# Altium schematic sheet Sheet1.SchDoc
size A3; SheetNumber: 1; SheetTotal: 1
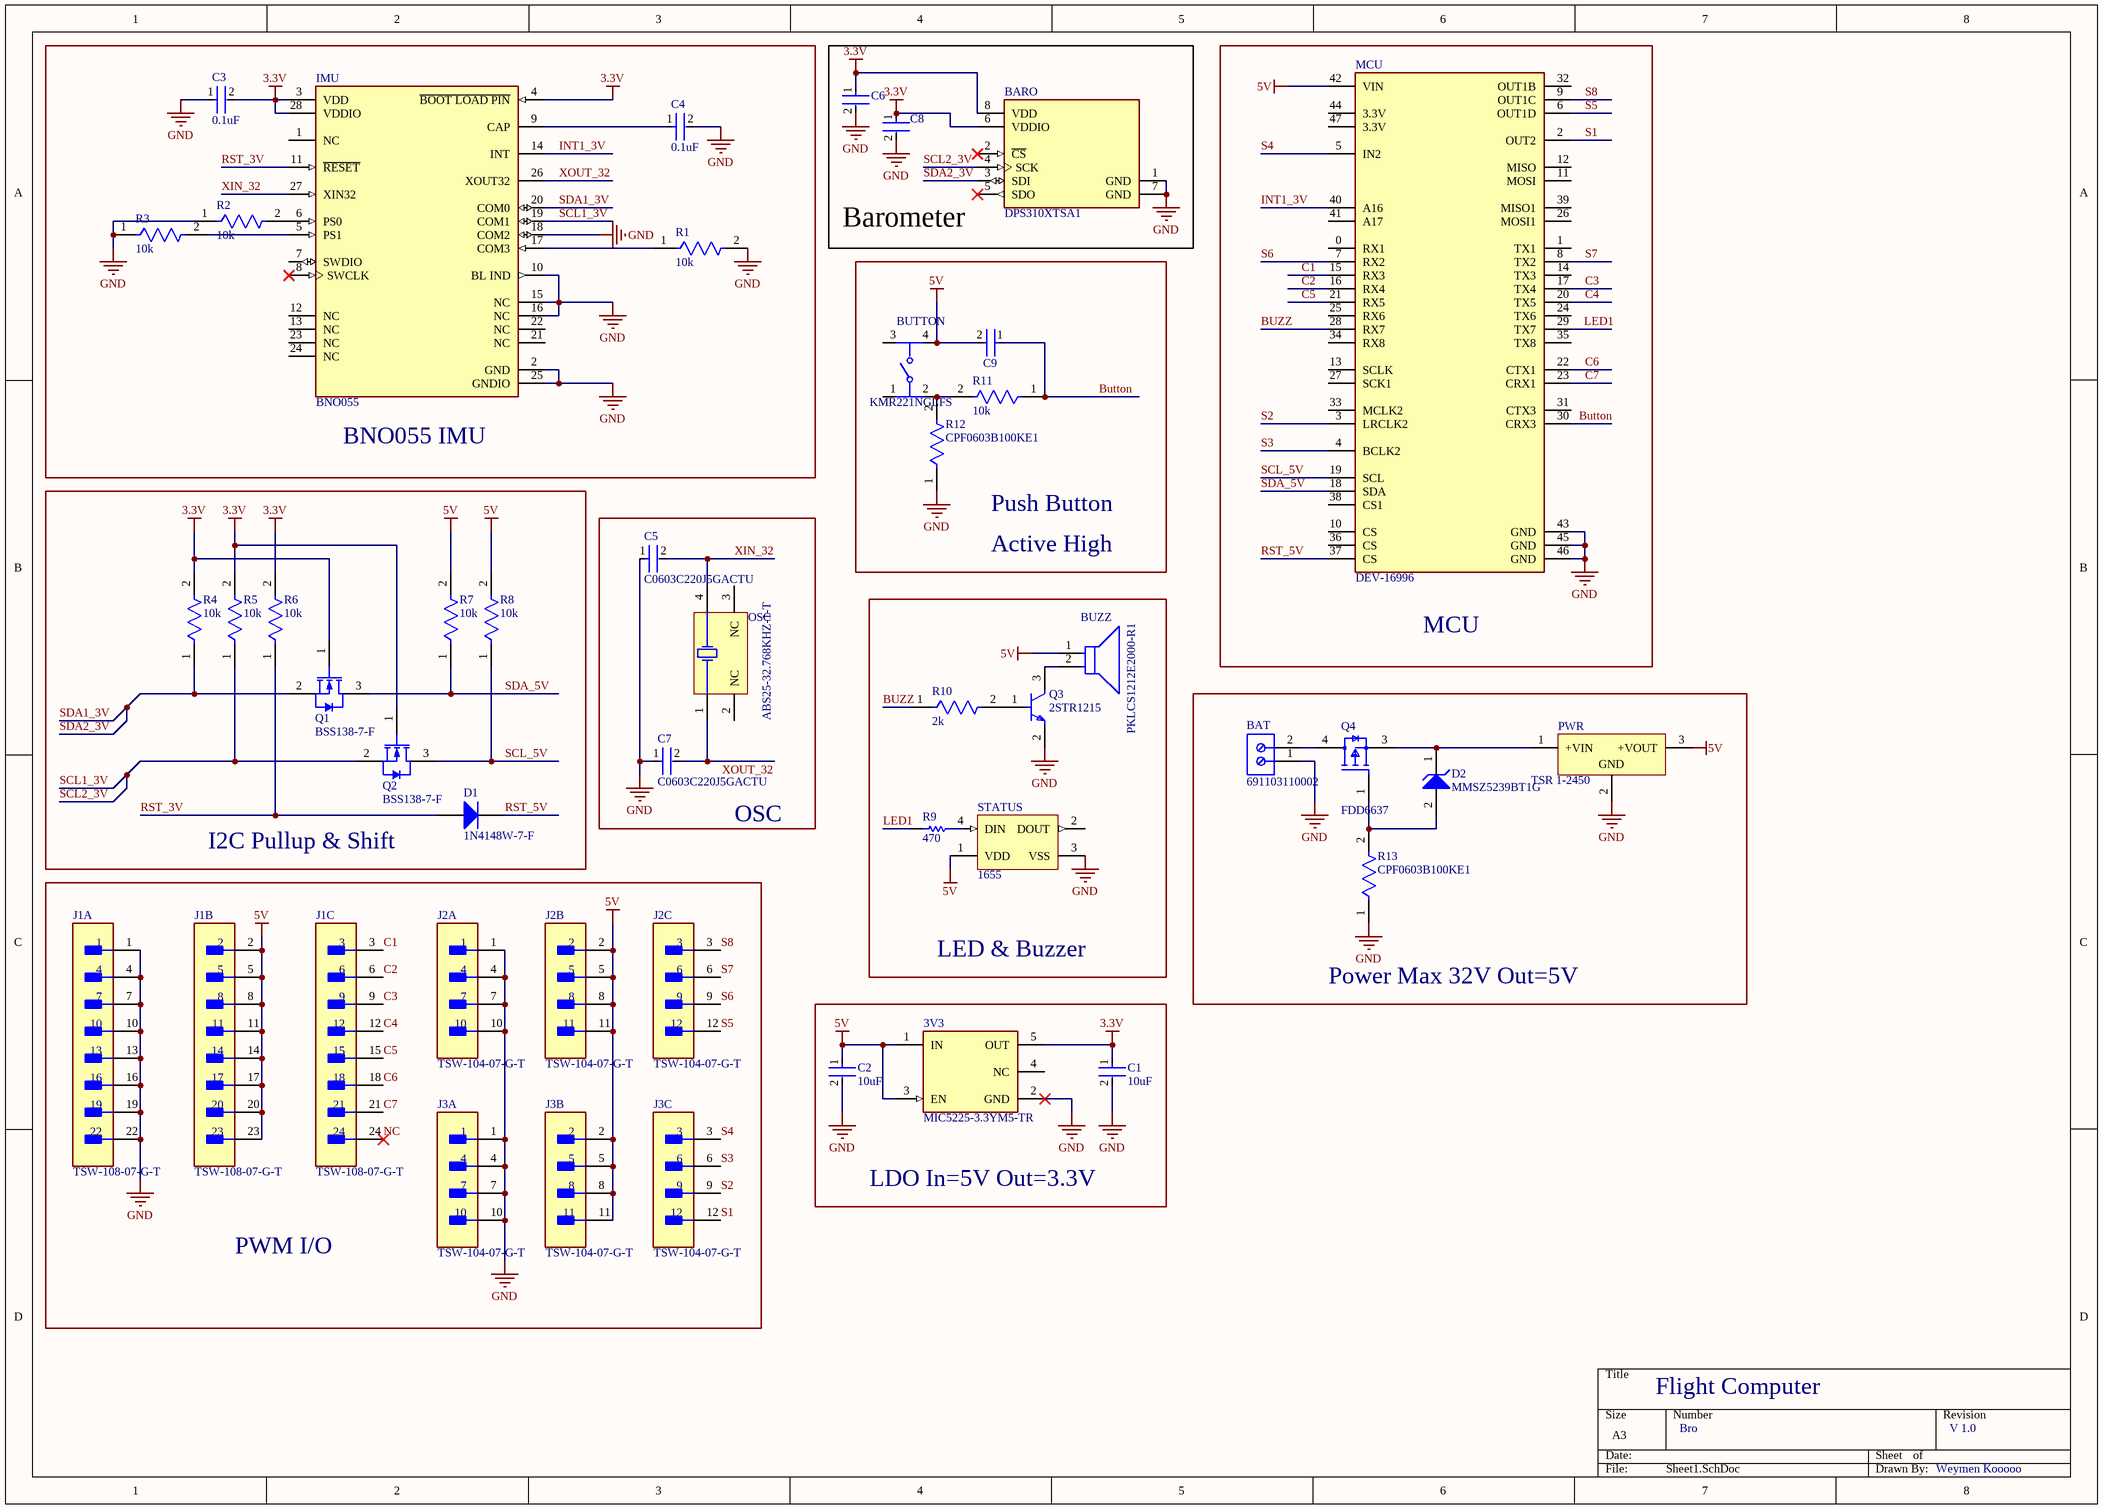
[diagram p0: Sheet1.SchDoc]

## Parts
3V3  MIC5225-3.3YM5-TR  [FP-SOT23-5LD-PL-1-MFG]
BARO  DPS310XTSA1  [FP-PG-VLGA-8-MFG]
BAT  691103110002  [691103110002]
BUTTON  KMR221NGLFS  [FP-KMR221NGLFS-0]
BUZZ  PKLCS1212E2000-R1  [FP-PKLCS1212E2000-R1-MFG]
C1  10uF  [FP-GRM188-0_1-e0_2_0_55-IPC_A]
C2  10uF  [FP-GRM188-0_1-e0_2_0_55-IPC_A]
C3  0.1uF  [FP-C0603C-CF-MFG]
C4  0.1uF  [FP-C0603C-CF-MFG]
C5  C0603C220J5GACTU  [FP-C0603C-CF-MFG]
C6  CGA3E2X7R1H104K080AA  [FP-CGA3E-0_3-0_1-IPC_A]  (value not drawn)
C7  C0603C220J5GACTU  [FP-C0603C-CF-MFG]
C8  CGA3E2X7R1H104K080AA  [FP-CGA3E-0_3-0_1-IPC_A]  (value not drawn)
C9  CGA3E2X7R1H104K080AA  [FP-CGA3E-0_3-0_1-IPC_A]  (value not drawn)
D1  1N4148W-7-F  [DIOD-SOD123-2_V]
D2  MMSZ5239BT1G  [ONSC-SOD-123-2-425-04_V]
IMU  BNO055  [FP-BNO055-MFG]
J1  TSW-108-07-G-T  [FP-TSW-108-07-G-T-MFG]  (parts A,B,C of 3)
J2  TSW-104-07-G-T  [FP-TSW-104-07-G-T-MFG]  (parts A,B,C of 3)
J3  TSW-104-07-G-T  [FP-TSW-104-07-G-T-MFG]  (parts A,B,C of 3)
MCU  DEV-16996  [FP-DEV-16996-MFG]  (no BOM)
OSC  ABS25-32.768KHZ-1-T  [ABRA-ABS25-4_V]
PWR  TSR 1-2450  [TRACO-SIP-3_V]
Q1  BSS138-7-F  [DIOD-SOT23-3_V]
Q2  BSS138-7-F  [DIOD-SOT23-3_V]
Q3  2STR1215  [FP-SOT23_8162275-MFG]
Q4  FDD6637  [FP-369AS-MFG]
R1  10k  [FP-RC0603-0_55-IPC_C]
R2  10k  [FP-RC0603-0_55-IPC_C]
R3  10k  [FP-RC0603-0_55-IPC_C]
R4  10k  [FP-RC0603-0_55-IPC_C]
R5  10k  [FP-RC0603-0_55-IPC_C]
R6  10k  [FP-RC0603-0_55-IPC_C]
R7  10k  [FP-RC0603-0_55-IPC_C]
R8  10k  [FP-RC0603-0_55-IPC_C]
R9  470  [RESC1608X55X30NL15T15]
R10  2k  [FP-ERA3A-IPC_C]
R11  10k  [FP-RC0603-0_55-IPC_C]
R12  CPF0603B100KE1  [FP-CPF0603-MFG]
R13  CPF0603B100KE1  [FP-CPF0603-MFG]
STATUS  1655  [ADA-RGB-1655_V]

## Blocks framed on the sheet
BNO055 IMU: C3 C4 IMU R1-R3
Barometer: BARO C6 C8
MCU: MCU
I2C Pullup & Shift: D1 Q1 Q2 R4-R8
OSC: C5 C7 OSC
LED & Buzzer: BUZZ Q3 R9 R10 STATUS
Power Max 32V Out=5V: BAT D2 PWR Q4 R13
PWM I/O: J1-J3
LDO In=5V Out=3.3V: 3V3 C1 C2

## Nets
3.3V: 3V3.5(OUT) BARO.6(VDDIO) BARO.8(VDD) C1.1 C3.2 C6.1 C8.1 IMU.3(VDD) IMU.4(~{BOOT_LOAD_PIN}) IMU.28(VDDIO) Q1.1(G) Q2.1(G) R4.2 R5.2 R6.2
5V: 3V3.1(IN) 3V3.3(EN) BUTTON.4 BUZZ.1 C2.1 C9.2 J1.2 J1.5 J1.8 J1.11 J1.14 J1.17 J1.20 J1.23 J2.2 J2.5 J2.8 J2.11 J3.2 J3.5 J3.8 J3.11 MCU.42(VIN) PWR.3(+VOUT) R7.2 R8.2 STATUS.1(VDD)
GND: 3V3.2(GND) BARO.1(GND) BARO.7(GND) BAT.1 C1.2 C2.2 C3.1 C4.2 C5.1 C6.2 C7.1 C8.2 IMU.2(GND) IMU.10(BL_IND) IMU.15(NC) IMU.16(NC) IMU.18(COM2) IMU.25(GNDIO) J1.1 J1.4 J1.7 J1.10 J1.13 J1.16 J1.19 J1.22 J2.1 J2.4 J2.7 J2.10 J3.1 J3.4 J3.7 J3.10 MCU.43(GND) MCU.45(GND) MCU.46(GND) PWR.2(GND) Q3.2(E) R1.2 R2.1 R3.1 R12.1 R13.1 STATUS.3(VSS)
Button: C9.1 MCU.30(CRX3) R11.1
BUZZ: MCU.28(RX7) R10.1
C1: J1.3 MCU.15(RX3)
C2: J1.6 MCU.16(RX4)
C3: J1.9 MCU.17(TX4)
C4: J1.12 MCU.20(TX5)
C5: J1.15 MCU.21(RX5)
C6: J1.18 MCU.22(CTX1)
C7: J1.21 MCU.23(CRX1)
INT1_3V: IMU.14(INT) MCU.40(A16)
LED1: MCU.29(TX7) R9.1
NC: J1.24
RST_3V: D1.1(A) IMU.11(~{RESET}) R6.1
RST_5V: D1.2(K) MCU.37(CS)
S1: J3.12 MCU.2(OUT2)
S2: J3.9 MCU.3(LRCLK2)
S3: J3.6 MCU.4(BCLK2)
S4: J3.3 MCU.5(IN2)
S5: J2.12 MCU.6(OUT1D)
S6: J2.9 MCU.7(RX2)
S7: J2.6 MCU.8(TX2)
S8: J2.3 MCU.9(OUT1C)
SCL1_3V: BARO.4(SCK) IMU.19(COM1) Q2.2(S) R5.1  [also labelled SCL2_3V]
SCL_5V: MCU.19(SCL) Q2.3(D) R8.1
SDA1_3V: BARO.3(SDI) IMU.20(COM0) Q1.2(S) R4.1  [also labelled SDA2_3V]
SDA_5V: MCU.18(SDA) Q1.3(D) R7.1
XIN_32: C5.2 IMU.27(XIN32) OSC.4(X2)
XOUT_32: C7.2 IMU.26(XOUT32) OSC.1(X1)
NetBAT_2: BAT.2 Q4.4(D)
NetBUTTON_2: BUTTON.2 R11.2 R12.2
NetBUZZ_2: BUZZ.2 Q3.3(C)
NetC4_1: C4.1 IMU.9(CAP)
NetD2_1: D2.1(K) PWR.1(+VIN) Q4.3(S)
NetD2_2: D2.2(A) Q4.1(G) R13.2
NetIMU_5: IMU.5(PS1) R3.2
NetIMU_6: IMU.6(PS0) R2.2
NetIMU_17: IMU.17(COM3) R1.1
NetQ3_1: Q3.1(B) R10.2
NetR9_2: R9.2 STATUS.4(DIN)

Not connected (* = marked no-connect by the designer): 3V3 4(NC); BARO 2(~{CS})* 5(SDO)*; BUTTON 1 3; IMU 1(NC) 7(SWDIO) 8(SWCLK)* 12(NC) 13(NC) 21(NC) 22(NC) 23(NC) 24(NC); MCU 0(RX1) 1(TX1) 10(CS) 11(MOSI) 12(MISO) 13(SCLK) 14(TX3) 24(TX6) 25(RX6) 26(MOSI1) 27(SCK1) 31(CTX3) 32(OUT1B) 33(MCLK2) 34(RX8) 35(TX8) 36(CS) 38(CS1) 39(MISO1) 41(A17) 44(3.3V) 47(3.3V); OSC 2(NC) 3(NC); STATUS 2(DOUT)

## Notes on the sheet
- Push Button
- Active High
- Flight Computer
- Bro
- V 1.0
- Weymen Kooooo

## Library data of the parts
3V3 = CMP-06324-000013-1: IC REG LINEAR 3.3V 150MA SOT23-5; Manufacturer: Microchip Technology; Max Supply Voltage: 16V; Output Type: Fixed; Accuracy Percentage: 1%; Number Of Outputs: 1; Standoff Height: 0mm; Min Supply Voltage: 2.3V; Dropout Voltage: 310mV; Max Junction Temp: +125°C; Nominal Supply Current: 29-3000uA; Output Current: 150mA; Height: 1.45mm; Device Class L3: Voltage Regulators - Linear; Temperature Range High: +125°C; Temperature Range Low: -40°C; Device Class L2: Power Management ICs; Device Class L1: Integrated Circuits (ICs); Manufacturer Part Number: MIC5225-3.3YM5-TR; Output Voltage: 3.3V; ComponentLink2Description: Datasheet; Package: SOT23-5LD-PL-1; ComponentLink2URL: http://ww1.microchip.com/downloads/en/DeviceDoc/mic5225.pdf; Mouser Description: LDO Voltage Regulators High Vin, Low Iq Regulator (Lead Free); RoHS: TRUE; Automotive: No; Temperature: -40°C to +125°C; Category: IC; Octopart: https://octopart.com/mic5225-3.3ym5-tr-microchip-66802280; Lead Free: Yes; Digikey Description: IC REG LINEAR 3.3V 150MA SOT23-5
BARO = CMP-32885-000002-2: SENSOR PRESSURE CAPACITIVE; Max Supply Voltage: 3.6V; Interface: I2C; Operating Pressure: 17.4PSI; Pressure Type: Vented Gauge; Max Pressure: 145PSI; Output Type: SPI; Min Operating Temperature: -40°C; Lead Free: Lead Free; Termination: SMD/SMT; Halogen Free: Halogen Free; Case/Package: LGA; Max Operating Temperature: 85°C; Number of Pins: 8
BAT = CMP-1502-03254-1: Series 1031 - 3.50 mm Horizontal Entry Modular with Pressure Clamp WR-TBL, 2 pin; Manufacturer: Wurth Elektronik; Pin Number: 2; Pitch: 3.50mm; Datasheet URL: http://katalog.we-online.de/em/datasheet/6911031100xx.pdf; Package Reference: 691103110002; Publisher: WurthElektronik; Manufacturer URL: http://www.we-online.de; Mounting Technology: THT; Operating Temperature: -40to105degC; Part Number: 691103110002; Packaging: Box
BUTTON = CMP-10040-000006-1: SWITCH TACTILE SPST-NO 0.05A 32V; Manufacturer: C&K; Contact Current Rating: 50mA; Operating Force: 2N; Contact Resistance: 100mΩ; Electromechanical Life: 200000Cycles; Digikey Description: SWITCH TACTILE SPST-NO 0.05A 32V; Manufacturer Part Number: KMR221NGLFS; Octopart: https://octopart.com/kmr221nglfs-c%26k+components-7203802; Package: 0; Temperature: -40°C to +85°C; Mount: Surface Mount; Device Class L2: Switches; Height: 1.9mm; Device Class L3: Tactile Switches; RoHS: TRUE; Lead Free: Yes; ComponentLink2Description: Datasheet; Device Class L1: Electromechanical; Automotive: No; Mouser Description: Tactile Switches Tact; Category: Switch; Temperature Range High: +85°C; Temperature Range Low: -40°C; Voltage Rating Dc: 32V; ComponentLink2URL: https://dznh3ojzb2azq.cloudfront.net/products/Tactile/KMR2/documents/datasheet.pdf; Throw Configuration: SPST-NO
BUZZ = CMP-06202-000001-1: AUDIO PIEZO TRANSDUCER 12.5V SMD; Manufacturer: Murata; Frequency: 2kHz; Digikey Description: AUDIO PIEZO TRANSDUCER 12.5V SMD; RoHS: TRUE; Device Class L3: Buzzers; Manufacturer Part Number: PKLCS1212E2000-R1; Automotive: No; Category: Speak; Height: 3mm; Operating Supply Voltage: 12.5V; Mouser Description: Piezo buzzer SMD; Temperature Range High: +70°C; Temperature Range Low: -20°C; ComponentLink2Description: Datasheet; ComponentLink2URL: https://www.murata.com/en-global/products/productdata/8801054425118/SPEC-PKLCS1212E2000-R1.pdf?1517839212000; Package: PKLCS1212E2000-R1; Device Class L1: Electromechanical; Device Class L2: Audio Products; Lead Free: Yes; Temperature: -20°C to +70°C; Octopart: https://octopart.com/pklcs1212e2000-r1-murata-7123179
C1 C2 = CMP-2006-02792-2: Chip Multilayer Ceramic Capacitors for General Purpose, 0603, 10uF, X5R, 15%, 20%, 6.3V; Packaging: Tape and Reel; Voltage Rating (DC): 6.3V; Width: 0.031inch; Termination: SMD/SMT; Dielectric: X5R; Package Quantity: 4000; Voltage Rating: 6.3V; Capacitance: 10uF; Case/Package: 0603; Min Operating Temperature: -55°C; Voltage: 6.3V; Length: 1.6mm; Thickness: 0.035inch; Lead Free: Lead Free; Depth: 0.8mm; Case Code (Imperial): 0603; Max Operating Temperature: 85°C; Material: Ceramic; Height: 0.8mm; Tolerance: 20%; Mount: Surface Mount; REACH SVHC: No SVHC; Radiation Hardening: No; Case Code (Metric): 1608
C3 C4 = CMP-2006-03061-2: CAP CER 0.1UF 50V X7R 0603; Manufacturer: KEMET; Manufacturer Part Number: C0603C104K5RACTU; Tolerance: 0.1; Temperature Coefficient: 30ppm/°C; Material: Ceramic; Automotive Grade: Grade 1; Value: 0.10 μF; Temperature: -55°C to +125°C; RoHS: TRUE; Temperature Range High: +125°C; Lead Free: Yes; Octopart: https://octopart.com/c0603c104k5ractu-kemet-139244; Digikey Description: CAP CER 0.1UF 50V X7R 0603; Category: Cap; Package: C0603C-CF; ComponentLink2Description: Datasheet; Temperature Range Low: -55°C; Device Class L1: Passive Components; Voltage Rating: 50 V; Automotive: Yes; Device Class L3: Ceramic Capacitors; ComponentLink2URL: https://api.kemet.com/component-edge/download/datasheet/C0603C100J5GACAUTO.pdf; Capacitance: 0.10 μF; Device Class L2: Capacitors; Temperature Characteristic: X7R; Height: 0.87mm
C5 C7 = CMP-2006-03119-3: Cap Ceramic 22pF 50V C0G 5% SMD 0603 125°C Paper T/R; Manufacturer: KEMET; Temperature Coefficient: 30ppm/°C; Automotive Grade: Grade 1; Tolerance: 0.05; RoHS: TRUE; Temperature Characteristic: C0G; Capacitance: 22 pF; Device Class L3: Ceramic Capacitors; Digikey Description: Cap Ceramic 22pF 50V C0G 5% SMD 0603 125°C Paper T/R; ComponentLink2URL: https://api.kemet.com/component-edge/download/datasheet/C0603C100J5GACAUTO.pdf; ComponentLink2Description: Datasheet; Automotive: Yes; Temperature: -55°C to +125°C; Temperature Range High: +125°C; Package: C0603C-CF; Device Class L1: Passive Components; Device Class L2: Capacitors; Lead Free: Yes; Value: 22 pF; Manufacturer Part Number: C0603C220J5GACTU; Category: Cap; Mouser Description: Cap Ceramic 22pF 50V C0G 5% SMD 0603 125°C Paper T/R; Voltage Rating: 50 V; Height: 0.87mm; Material: Ceramic; Temperature Range Low: -55°C; Octopart: https://octopart.com/c0603c220j5gactu-kemet-98525
C6 C8 C9 = CMP-2000-07546-2: Cap Ceramic 100nF 50V X7R 10% Pad SMD 0603 +125°C Automotive T/R; Weight: 7.1E-05oz; Composition: Ceramic; Max Operating Temperature: 125°C; Termination: SMD/SMT; Dielectric: X7R; Length: 1.6mm; Package Quantity: 1; REACH SVHC: No SVHC; Lead Free: Lead Free; Case Code (Metric): 1608; Min Operating Temperature: -55°C; Packaging: Tape and Reel; Tolerance: 10%; Voltage Rating: 50V; Case Code (Imperial): 0603; Capacitance: 100nF; Case/Package: 0603; Voltage Rating (DC): 50V; Depth: 0.8mm; Radiation Hardening: No; Ratings: AEC-Q200; Mount: Surface Mount; Voltage: 50V; Thickness: 0.035inch; Width: 0.8mm; Height: 0.8mm
D1 = CMP-2000-04932-2: Fast Switching Diode, 100 V, 0.15 A, -65 to 150 degC, 2-Pin?SOD123, RoHS, Tape and Reel; Recovery Time: 4ns; Brand: DiodesIncorporated; Unit Weight: 0.000353oz; Max Surge Current: 2A; Peak Reverse Voltage: 100V; Ir - Reverse Current: 1uA; Vf - Forward Voltage: 1.25V; Configuration: Single; If - Forward Current: 0.15A; Product Category: Diodes-GeneralPurpose,Power,Switching; Operating Temperature Range: -65Cto+150C; Packaging: Reel; Manufacturer URL: http://www.diodes.com/; Maximum Operating Temperature: +150C; Height: 1.25mm; Minimum Operating Temperature: -65C; Product: SwitchingDiodes; Package URL: http://www.diodes.com/datasheets/ds18004.pdf; Type: SwitchingDiode; Package Reference: SOD123-2; Width: 1.7mm; Datasheet URL: http://www.farnell.com/datasheets/1915529.pdf; Datasheet Version: Rev. 24-2, 10/2013; Series: 1N4148; Factory Pack Quantity: 3000; Length: 2.85mm; RoHS: True; Manufacturer: DiodesIncorporated; Mounting Style: SMD/SMT; Package / Case: SOD-123
D2 = CMP-1060-00547-1: Zener Voltage Regulator, 500 mW, 2-Pin SOD-123, Pb-Free, Tape and Reel; Manufacturer: On Semiconductor; P Max (W): 0.5; VZ Typ (V): 9.1; DatasheetVersion: Rev. 12; ComponentLink1Description: Manufacturer URL; ComponentLink1URL: http://www.onsemi.com/; PartNumber: MMSZ5239BT1G; ComponentLink3Description: Package Specification; PackageDescription: 2-Pin SOD, Body 1.6 x 2.69 mm; ComponentLink2Description: Datasheet; PackageVersion: Rev. G, 10/2009; ComponentLink3URL: http://www.onsemi.com/pub_link/Collateral/425-04.PDF; Packing: Tape and Reel; ComponentLink2URL: http://www.onsemi.com/pub_link/Collateral/MMSZ5221BT1-D.PDF; RoHS: Pb-Free; PackageReference: SOD-123-2-425-04; Mounting Technology: Surface Mount
IMU = CMP-2000-05075-4: IMU ACCEL/GYRO/MAG I2C 28LGA; Sensor Type: Accelerometer; Packaging: Tape and Reel; Case/Package: LGA; Min Operating Temperature: -40°C; Mount: Surface Mount; Output Type: I2C; Lead Free: Lead Free; Max Operating Temperature: 85°C
J1 = CMP-02766-000095-1: CONN HEADER VERT 24POS 2.54MM; Max Voltage Rating (AC): 550V; Number of Positions: 24; Row Spacing: 0.1inch; Connector Type: Male Pin; Max Current Rating: 7.6A; Gender: Male; Depth: 7.62mm; Packaging: Rail/Tube; Number of Contacts: 24; Package Quantity: 1; Lead Free: Lead Free; Number of Rows: 3; REACH SVHC: No SVHC; Housing Material: Polyester; Contact Plating: Gold; Mount: Through Hole; Pitch: 2.54mm; Housing Color: Black; Contact Material: Bronze; Min Operating Temperature: -55°C; Max Operating Temperature: 125°C; Length: 20.32mm; Termination: Solder; Color: Black; Contact Mating Length: 0.23inch; Radiation Hardening: No; Orientation: Straight
J2 J3 = CMP-1024-00347-2: CONN HEADER VERT 12POS 2.54MM; Manufacturer: Samtec; Conn Orientation: Straight; Number Of Contacts: 12; Conn Gender: Male; Automotive: No; RoHS: TRUE; Number Of Rows: 3; Footprint Url: http://suddendocs.samtec.com/prints/tsw-xxx-xx-x-x-xx-xxx-footprint.pdf; Manufacturer Part Number: TSW-104-07-G-T; Temperature Range High: +125°C; Device Class L2: Headers and Wire Housings; Digikey Description: CONN HEADER VERT 12POS 2.54MM; Pitch: 2.54mm; Device Class L1: Connectors; Category: Conn; Device Class L3: unset; Octopart: https://octopart.com/tsw-104-07-g-t-samtec-8296723; Package: TSW-104-07-G-T; Lead Free: Yes; Height: 8.64mm; ComponentLink2Description: Datasheet; Contact Material: Gold,Nickel; Temperature Range Low: -55°C; ComponentLink2URL: http://suddendocs.samtec.com/prints/tsw-xxx-xx-xxx-x-xx-xxx-mkt.pdf; Temperature: -55°C to +125°C
MCU = CMP-157412-000001-1: TEENSY 4.1 (HEADERS)
OSC = CMP-2000-05736-1: Low Frequency Crystal, 32.768 KHz, -40 to 85 degC, 4-Pin SMD, RoHS, Tape and Reel; Manufacturer: ABRACON; Case Height: 2.5mm; Case Length: 8mm; Case Width: 3.8mm; Load Capacitance: 12.5pF; ESR: 50kOhms; Tolerance: 10PPM; Series: ABS25; Manufacturer URL: http://www.abracon.com/; RoHS: Details; Mounting Style: SMD/SMT; Package Reference: ABS25; Factory Pack Quantity: 3000; Dimensions: 3.8mmWx8mmLx2.5mmH; Package / Case: 8mmx3.8mm; Datasheet URL: http://www.abracon.com/Resonators/abs25.pdf; Termination Style: SMD/SMT; Datasheet Version: 12/2015; Packaging: Reel; Type: LowFrequencyCrystal; Brand: ABRACON; Product Category: Crystals; Operating Temperature Range: -40Cto+85C; Package Description: 4-Pin Surface Mount Device, Body 8 x 3.8 mm, Pitch 5.5 mm; Mounting Technology: SurfaceMount; Frequency: 32.768kHz
PWR = CMP-2000-05427-1: DC/DC converter, 5 VDC, 1000 mA, -40 to 85 degC, 3-Pin SIP, RoHS; Manufacturer: Tracopower; Output Voltage Nom.: 5V; Output Current Max: 1A; Product Range: TSR-1Series; DC / DC Converter Mounting: ThroughHole; Output Power Max: 5W; No. of Outputs: 1Output; Input Voltage DC Max: 36V; Approvals & Standards: IEC,UL; Input Voltage DC Min: 6.5V; DC / DC Converter Output Type: Fixed; Depth: 11.7mm; Package Reference: SIP-3; DC / DC Converter Type: SIP; Height: 10.2mm; Width: 7.6mm; Package Description: 3-Pin Single In-line Package, Body 11.7 x 7.6 mm, Pitch 2.54 mm; Manufacturer URL: http://www.tracopower.com/home; Datasheet Version: Jan-15; Datasheet URL: https://datasheet.ciiva.com/6815/tsr1-6815641.pdf
Q1 Q2 = CMP-2000-04930-1: N-Channel Enhancement Mode Mosfet, 50 V, 0.2 A, -55 to 150 degC, 3-Pin SOT23, RoHS, Tape and Reel; Manufacturer: Diodes Inc; Brand: DiodesIncorporated; Unit Weight: 0.000282oz; Pd - Power Dissipation: 300mW; Id - Continuous Drain Current: 200mA; Rds On - Drain-Source Resistance: 3.5Ohms; Vgs - Gate-Source Voltage: 20V; Number of Channels: 1Channel; Vds - Drain-Source Breakdown Voltage: 50V; Transistor Type: 1N-Channel; Typical Turn-Off Delay Time: 20ns; Configuration: Single; Mounting Style: SMD/SMT; Height: 1mm; Package Description: 3-Pin Small Outline Transistor, Body 2.9 x 1.3 mm, Pitch 0.96 mm; Datasheet Version: Rev. 20-2, 11/2013; Minimum Operating Temperature: -55C; Package / Case: SOT-23-3; Channel Mode: Enhancement; Product: MOSFETSmallSignal; Packaging: Reel; Maximum Operating Temperature: +150C; Datasheet URL: https://datasheet.ciiva.com/8115/ds30144-8115344.pdf; Product Category: MOSFET; Width: 1.3mm; Technology: Si; Package Reference: SOT23-3; Manufacturer URL: http://www.diodes.com/; Transistor Polarity: N-Channel; Length: 2.9mm; Factory Pack Quantity: 3000; Series: BSS138; RoHS: True; Typical Turn-On Delay Time: 20ns
Q3 = CMP-12195-000010-1: TRANS NPN 15V 1.5A SOT-23; Collector Emitter Saturation Voltage: 850mV; Max Power Dissipation: 500mW; Emitter Base Voltage (VEBO): 5V; Number of Elements: 1; Element Configuration: Single; Mount: Surface Mount; Polarity: NPN; Max Breakdown Voltage: 15V; Collector Emitter Voltage (VCEO): 15V; Collector Base Voltage (VCBO): 15V; Package Quantity: 1; Max Collector Current: 1.5A; Radiation Hardening: No; Width: 1.3mm; Length: 2.9mm; Power Dissipation: 500mW; Height: 0.95mm; REACH SVHC: No SVHC; Number of Pins: 3; Packaging: Tape and Reel; Contact Plating: Tin; Lead Free: Lead Free; Min Operating Temperature: -65°C; Collector Emitter Breakdown Voltage: 15V; Max Operating Temperature: 150°C; Case/Package: SOT-23
Q4 = CMP-07173-000090-1: MOSFET P-CH 35V 13A DPAK; Manufacturer: ON Semiconductor; Threshold Vgs Max: -3V; Transconductance: 35S; Rthja Max: 96°C/W; Pulse Drain Current: -100A; Reverse Recovery Time: 28ns; Number Of P Channels: 1; Drain To Source Voltage: -35V; Turn On Delay Time: 18ns; Depletion Mode: False; Turn Off Delay Time: 62ns; Max Junction Temp: +150°C; Gate To Source Voltage: 25V; Gate Charge At Vgs: 45nC @ -10V; Threshold Vgs Min: -1V; Drain To Source Resistance: 9.7mΩ; Power Dissipation: 1.3W; Typ Forward Diode Voltage: -0.8V; Input Capacitace At Vds: 2370pF @ -20V; Max Forward Diode Voltage: -1.2V; Continuous Drain Current: -13A; Reverse Recovery Charge: 15nC; Temperature: -55°C to +150°C; Package: 369AS; Device Class L2: Transistors; Automotive: No; ComponentLink2URL: https://www.onsemi.com/pub/Collateral/FDD6637-D.pdf; Temperature Range Low: -55°C; Manufacturer Part Number: FDD6637; Number Of Channels: 1; Lead Free: Yes; Temperature Range High: +150°C; ComponentLink2Description: Datasheet; RoHS: TRUE; Octopart: https://octopart.com/fdd6637-on+semiconductor-84325825; Drain To Source Breakdown Voltage: -35V; Footprint Url: https://www.onsemi.com/pub/Collateral/369AS.PDF; Category: Trans; Device Class L1: Discrete Semiconductors; Digikey Description: MOSFET P-CH 35V 13A DPAK; Device Class L3: MOSFETs; Mouser Description: MOSFET 35V PCH PowerTrench MOSFET; Height: 2.517mm
R1-R8 R11 = CMP-2100-03664-2: RES 10K OHM 1% 1/10W 0603; Voltage Rating: 75V; Voltage Rating (DC): 50V; Resistance: 10kR; Power Rating: 100mW; Temperature Coefficient: 100ppm/°C; Depth: 0.8mm; Termination: SMD/SMT; Resistor Type: Thick Film; Series: RC; Construction: Rectangular; Features: Moisture Resistant; Packaging: Tape and Reel; Min Operating Temperature: -55°C; Number of Terminations: 2; Lead Pitch: 0.3mm; RoHS Compliant: Yes; Case/Package: 0603; Resistance Tolerance: 1%; Military Standard: Not; Weight: 7.1E-05oz; Number of Pins: 2; Tolerance: 1%; Length: 1.6mm; Case Code (Imperial): 0603; Lead Free: Lead Free; Width: 0.8mm; Max Power Dissipation: 100mW; Height: 0.45mm; Max Operating Temperature: 155°C; Case Code (Metric): 1608; Size Code: 0603
R9 = CMP-2000-00795-1: Part Number: ERJ-3GEYJ471V; Manufacturer: Panasonic
R10 = CMP-2000-00945-2: RES SMD 2K OHM 0.1% 1/10W 0603; Resistance: 2kR; Max Power Dissipation: 100mW; Voltage Rating (DC): 75V; Temperature Coefficient: 25ppm/°C; REACH SVHC: No SVHC; Number of Terminations: 2; RoHS Compliant: Yes; Case Code (Metric): 1608; Package Quantity: 5000; Width: 0.8mm; Mount: Surface Mount; Series: ERA-3A; Number of Pins: 2; Height: 0.45mm; Military Standard: Not; Packaging: Tape and Reel; Resistor Type: Thin Film; Lead Free: Lead Free; Construction: Rectangular; Max Operating Temperature: 155°C; Contact Plating: Tin; Termination: SMD/SMT; Technology: THIN FILM; Length: 1.6mm; Power Rating: 100mW; Resistance Tolerance: 0.1%; Working Voltage: 75V; Voltage Rating: 75V; Depth: 0.8mm; Case Code (Imperial): 0603; Radiation Hardening: No; Case/Package: 0603; Tolerance: 0.1%; Min Operating Temperature: -55°C
R12 R13 = CMP-03211-008043-1: RES SMD 100KΩ 0.1% 1/16W 0603; Manufacturer: TE Connectivity; Voltage Rating: 50V; Power Rating: 0.063W; Temperature Coefficient: 25ppm/°C; Device Class L2: Resistors; Height: 0.55mm; Temperature Range High: +155°C; RoHS: TRUE; Composition: Thin Film; packaging: 1k Reel; Octopart: https://octopart.com/cpf0603b100ke1-te+connectivity-9539443; Tolerance: 0.1%; Temperature Range Low: -55°C; octopart_url: https://octopart.com/cpf0603b100ke1-te+connectivity-9539443; Category: Res; Manufacturer Part Number: CPF0603B100KE1; Resistance: 100KΩ; ComponentLink2Description: Datasheet; ComponentLink2URL: https://www.te.com/commerce/DocumentDelivery/DDEController?Action=showdoc&DocId=Data+Sheet%7F1773200%7FM%7Fpdf%7FEnglish%7FENG_DS_1773200_M.pdf%7F3-1676481-2; Device Class L1: Passive Components; Package: CPF0603; Value: 100KΩ; Series: CPF; Automotive: No; Ipc Land Pattern Name: RESC15580X45; Lead Free: Yes; Temperature: -55°C to +155°C; Device Class L3: Chip SMD Resistors
STATUS = CMP-2000-05026-1: Intelligent Control LED Integrated Light Source, 3.5 to 5.3 V, -25 to 80 degC, 4-Pin SMD, RoHS, Tape and Reel; Manufacturer: Adafruit-Industries-LLC; Number of LEDs: 10; Configuration: Discrete; Utilized LED: WS2812(5050); Datasheet URL: http://datasheet.octopart.com/ADA1655-Adafruit-Industries-datasheet-32028139.pdf; Series: Neopixel; Interface: -; Package Description: 4-Pin Surface Mount Device, Body 5 x 5 mm; Color: Red,Green,Blue(RGB); Category: Optoelectronics; Controller Type: -; Package Reference: 1655; Manufacturer URL: https://www.adafruit.com/; Mounting Type: SurfaceMount; Datasheet Version: May-13; Size / Dimension: 5.00mmLx5.00mmW; Family: Addressable,Specialty